# Altium project Controle1.PrjPcb
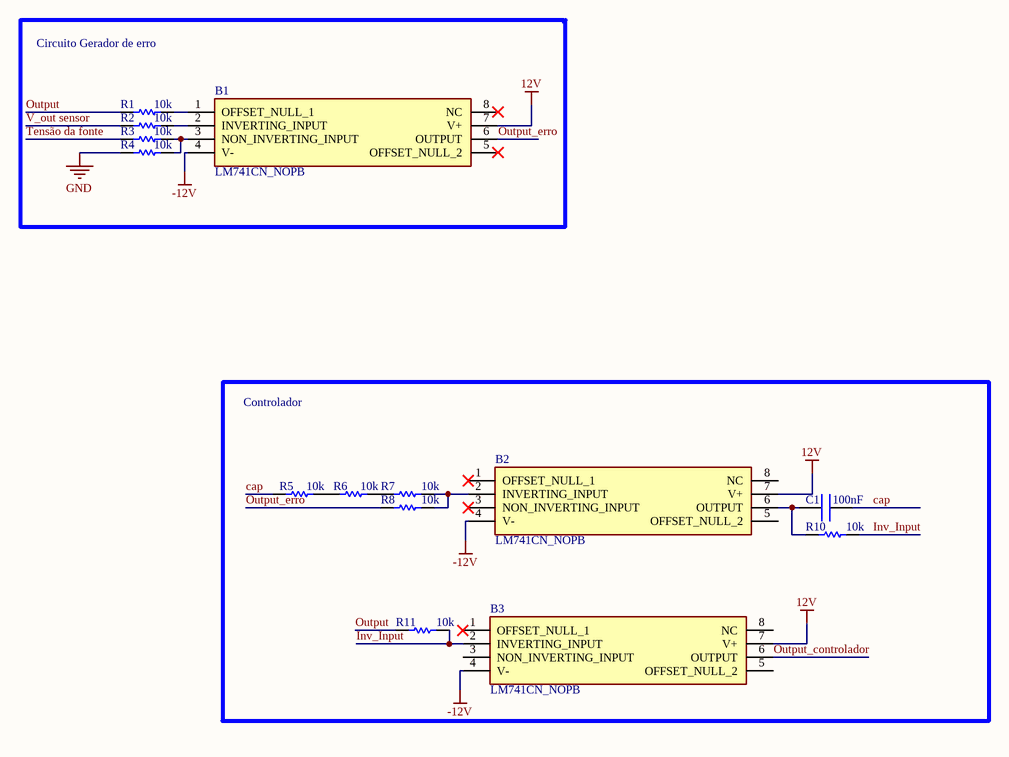
[diagram p0: Controle1.SchDoc]
1 sheet, 14 parts. Net scope: global (net labels, ports and power ports of the same name join across sheets).

## Sheet Controle1.SchDoc
size A4

### Parts
B1  LM741CN_NOPB  [DIP794W53P254L959H508Q8N]
B2  LM741CN_NOPB  [DIP794W53P254L959H508Q8N]
B3  LM741CN_NOPB  [DIP794W53P254L959H508Q8N]
C1  100nF  [C0805]
R1  10k  [RESAD1075W45L335D185]
R2  10k  [RESAD1075W45L335D185]
R3  10k  [RESAD1075W45L335D185]
R4  10k  [RESAD1075W45L335D185]
R5  10k  [RESAD1075W45L335D185]
R6  10k  [RESAD1075W45L335D185]
R7  10k  [RESAD1075W45L335D185]
R8  10k  [RESAD1075W45L335D185]
R10  10k  [RESAD1075W45L335D185]
R11  10k  [RESAD1075W45L335D185]

### Blocks framed on the sheet
Circuito Gerador de erro: B1 R1-R4
Controlador: B2 B3 C1 R5-R8 R10 R11

### Nets
12V: B1.7(V+) B2.7(V+) B3.7(V+)
-12V: B1.4(V-) B2.4(V-) B3.4(V-)
GND: R4.1
cap: C1.2 R5.1
Inv_Input: B3.2(INVERTING_INPUT) R10.2 R11.2
Output: R1.1 R11.1
Output_controlador: B3.6(OUTPUT)
Output_erro: B1.6(OUTPUT) R8.1
Tensão da fonte: R3.1
V_out sensor: R2.1
NetB1_1: B1.1(OFFSET_NULL_1) R1.2
NetB1_2: B1.2(INVERTING_INPUT) R2.2
NetB1_3: B1.3(NON_INVERTING_INPUT) R3.2 R4.2
NetB2_2: B2.2(INVERTING_INPUT) R7.2 R8.2
NetB2_6: B2.6(OUTPUT) C1.1 R10.1
NetR5_2: R5.2 R6.1
NetR6_2: R6.2 R7.1

Not connected (* = marked no-connect by the designer): B1 5(OFFSET_NULL_2)* 8(NC)*; B2 1(OFFSET_NULL_1)* 3(NON_INVERTING_INPUT)* 5(OFFSET_NULL_2) 8(NC); B3 1(OFFSET_NULL_1)* 3(NON_INVERTING_INPUT) 5(OFFSET_NULL_2) 8(NC)

### Library data of the parts
B1-B3 = LM741CN_NOPB: LM741 Operational Amplifier 1MHz DIP8 Texas Instruments LM741CN/NOPB Op Amp, 1MHz, 8-Pin MDIP; Geometry.Height: 5.08mm; Mouser Part Number: 926-LM741CN/NOPB; Mouser Price/Stock: https://www.mouser.co.uk/ProductDetail/Texas-Instruments/LM741CN-NOPB?qs=QbsRYf82W3Gt6%252BDX6%252BuAjw%3D%3D; Manufacturer_Name: Texas Instruments; Manufacturer_Part_Number: LM741CN/NOPB; Datasheet Link: https://datasheet.datasheetarchive.com/originals/distributors/Datasheets-SFU2/DSASFU100036484.pdf
C1 = C0805C104M3RACTU: Cap Ceramic 0.1uF 25V X7R 20% SMD 0805 125°C Paper T/R; Manufacturer: KEMET; Dissipation Factor: 5%; Supplier 1: Digi-Key; Manufacturer Part Number: C0805C104M3RACTU; RoHS: Yes; Stock 1: 190801; Pricing 1: 1 = 0,10000, 10 = 0,06200, 50 = 0,03360, 100 = 0,02750, 500 = 0,01964, 1000 = 0,01543 (USD); Mount: Surface Mount; Case/Package: 0805; Case Code (Metric): 2012; Case Code (Imperial): 0805; Dielectric Material: Ceramic; Min Operating Temperature: -55°C; Max Operating Temperature: 125°C; Package Quantity: 1; Capacitance: 100nF; Voltage Rating: 25V; Tolerance: 20%; Packaging: Tape and Reel; Voltage Rating (DC): 25V; Dielectric: X7R; Termination: SMD/SMT; Voltage: 25V; Series: C0805C; Construction: Flat; Length: 2mm; Width: 0.049inch; Height: 0.9mm; Thickness: 0.035inch; Lead Pitch: 0.75mm; Depth: 1.25mm; Radiation Hardening: No; REACH SVHC: No SVHC; ComponentLink1URL: http://www.farnell.com/datasheets/2746330.pdf?src-supplier=Farnell; ComponentLink1Description: http://www.farnell.com/datasheets/2746330.pdf?src-supplier=Farnell; ComponentLink2URL: https://www.alliedelec.com/m/d/6f3b5eb83d09db50ed28bdc730567b33.pdf?src-supplier=Allied+Electronics; ComponentLink2Description: https://www.alliedelec.com/m/d/6f3b5eb83d09db50ed28bdc730567b33.pdf?src-supplier=Allied+Electronics; ComponentLink3URL: http://uk.rs-online.com/webdocs/13da/0900766b813daa05.pdf?src-supplier=RSComponents; ComponentLink3Description: http://uk.rs-online.com/webdocs/13da/0900766b813daa05.pdf?src-supplier=RSComponents; ComponentLink4URL: http://uk.rs-online.com/webdocs/13da/0900766b813da9ff.pdf?src-supplier=RSComponents; ComponentLink4Description: http://uk.rs-online.com/webdocs/13da/0900766b813da9ff.pdf?src-supplier=RSComponents; ComponentLink5URL: https://www.alliedelec.com/m/d/e7aa2b5497e2375e4ffc0e8be19e16e2.pdf?src-supplier=Allied+Electronics; ComponentLink5Description: https://www.alliedelec.com/m/d/e7aa2b5497e2375e4ffc0e8be19e16e2.pdf?src-supplier=Allied+Electronics; ComponentLink6URL: http://www.jameco.com/Jameco/Products/ProdDS/1566487.pdf?src-supplier=Jameco; ComponentLink6Description: http://www.jameco.com/Jameco/Products/ProdDS/1566487.pdf?src-supplier=Jameco; ComponentLink7URL: http://www.mouser.com/ds/2/212/KEM_C1002_X7R_SMD-1102033.pdf?src-supplier=Mouser; ComponentLink7Description: http://www.mouser.com/ds/2/212/KEM_C1002_X7R_SMD-1102033.pdf?src-supplier=Mouser; ComponentLink8URL: http://components.arrow.com/part/dataview/2091097S3491315N7429?src-supplier=Arrow+Electronics; ComponentLink8Description: http://components.arrow.com/part/dataview/2091097S3491315N7429?src-supplier=Arrow+Electronics; ComponentLink9URL: http://components.arrow.com/part/dataview/0323_00178100?src-supplier=Arrow+Europe; ComponentLink9Description: http://components.arrow.com/part/dataview/0323_00178100?src-supplier=Arrow+Europe; ComponentLink10URL: https://api.kemet.com/component-edge/download/datasheet/C0805C104M3RACTU.pdf?src-supplier=Digi-Key; ComponentLink10Description: https://api.kemet.com/component-edge/download/datasheet/C0805C104M3RACTU.pdf?src-supplier=Digi-Key; ComponentLink11URL: http://www.farnell.com/datasheets/2746330.pdf?src-supplier=Newark; ComponentLink11Description: http://www.farnell.com/datasheets/2746330.pdf?src-supplier=Newark; ComponentLink12URL: http://www.farnell.com/datasheets/1828800.pdf?src-supplier=Newark; ComponentLink12Description: http://www.farnell.com/datasheets/1828800.pdf?src-supplier=Newark; ComponentLink13URL: http://capacitoredge.kemet.com/capedge2/DataSheet?pn=C0805C104M3RACTU&src-supplier=Avnet; ComponentLink13Description: http://capacitoredge.kemet.com/capedge2/DataSheet?pn=C0805C104M3RACTU&src-supplier=Avnet; ComponentLink14URL: http://www.farnell.com/datasheets/2746330.pdf?src-supplier=Element14; ComponentLink14Description: http://www.farnell.com/datasheets/2746330.pdf?src-supplier=Element14; Supplier Part Number 1: 399-C0805C104M3RAC7800CT-ND
R1-R8 R10 R11 = MF1/4CL1002F: Manufacturer: Yageo; Manufacturer Part Number: RC0603FR-0710KL; Resistance: 10kR; Tolerance: 1%; Temperature Coefficient: 100ppm/°C; Voltage Rating (DC): 50V; Power Rating: 100mW; Voltage Rating: 75V; Supplier 1: Digi-Key; RoHS: Yes; Stock 1: 18983194; Pricing 1: 1 = 0,10000, 10 = 0,02100, 100 = 0,00850, 1000 = 0,00382, 2500 = 0,00331 (USD); Case/Package: 0603; Number of Pins: 2; Weight: 7.1E-05oz; Case Code (Imperial): 0603; Case Code (Metric): 1608; Min Operating Temperature: -55°C; Max Operating Temperature: 155°C; Packaging: Tape and Reel; Resistor Type: Thick Film; Termination: SMD/SMT; Length: 1.6mm; Height: 0.45mm; Width: 0.8mm; Depth: 0.8mm; Lead Pitch: 0.3mm; REACH SVHC: No SVHC; Lead Free: Lead Free; Military Standard: Not; ComponentLink1URL: https://datasheet.ciiva.com/7660/38590-7660789.pdf?src-supplier=Element14; ComponentLink1Description: https://datasheet.ciiva.com/7660/38590-7660789.pdf?src-supplier=Element14; ComponentLink2URL: https://datasheet.ciiva.com/15189/getdatasheetpartid-409289-15189591.pdf?src-supplier=Verical; ComponentLink2Description: https://datasheet.ciiva.com/15189/getdatasheetpartid-409289-15189591.pdf?src-supplier=Verical; ComponentLink3URL: https://datasheet.ciiva.com/46440/1868787-46440891.pdf?src-supplier=Element14; ComponentLink3Description: https://datasheet.ciiva.com/46440/1868787-46440891.pdf?src-supplier=Element14; ComponentLink4URL: https://datasheet.ciiva.com/7983/443971-7983596.pdf?src-supplier=Element14; ComponentLink4Description: https://datasheet.ciiva.com/7983/443971-7983596.pdf?src-supplier=Element14; ComponentLink5URL: https://datasheet.ciiva.com/7746/1738695-7746239.pdf?src-supplier=Element14; ComponentLink5Description: https://datasheet.ciiva.com/7746/1738695-7746239.pdf?src-supplier=Element14; ComponentLink6URL: https://datasheet.ciiva.com/22747/443971-22747519.pdf?src-supplier=Element14; ComponentLink6Description: https://datasheet.ciiva.com/22747/443971-22747519.pdf?src-supplier=Element14; Supplier Part Number 1: 311-10.0KHRCT-ND